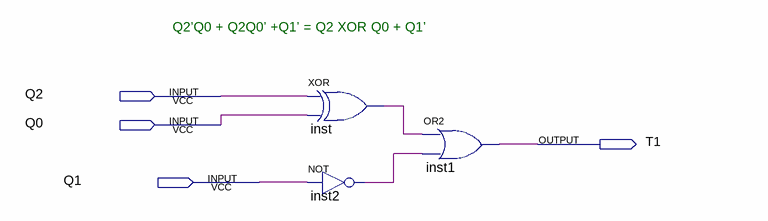
[diagram p0: schematic sheet]
// Quartus schematic T1.bdf as structural Verilog: 3 symbols, 4 pins
module T1 (
  input  Q2,
  input  Q0,
  input  Q1,
  output T1
);

  wire inst2_out, inst_out;

  xor inst (inst_out, Q2, Q0);
  not inst2 (inst2_out, Q1);
  or inst1 (T1, inst_out, inst2_out);

  // Notes on the sheet:
  //   Q2’Q0 + Q2Q0’ +Q1’ = Q2 XOR Q0 + Q1’
endmodule
